# Altium schematic sheet [07]CPU-Periph.SchDoc
size A3
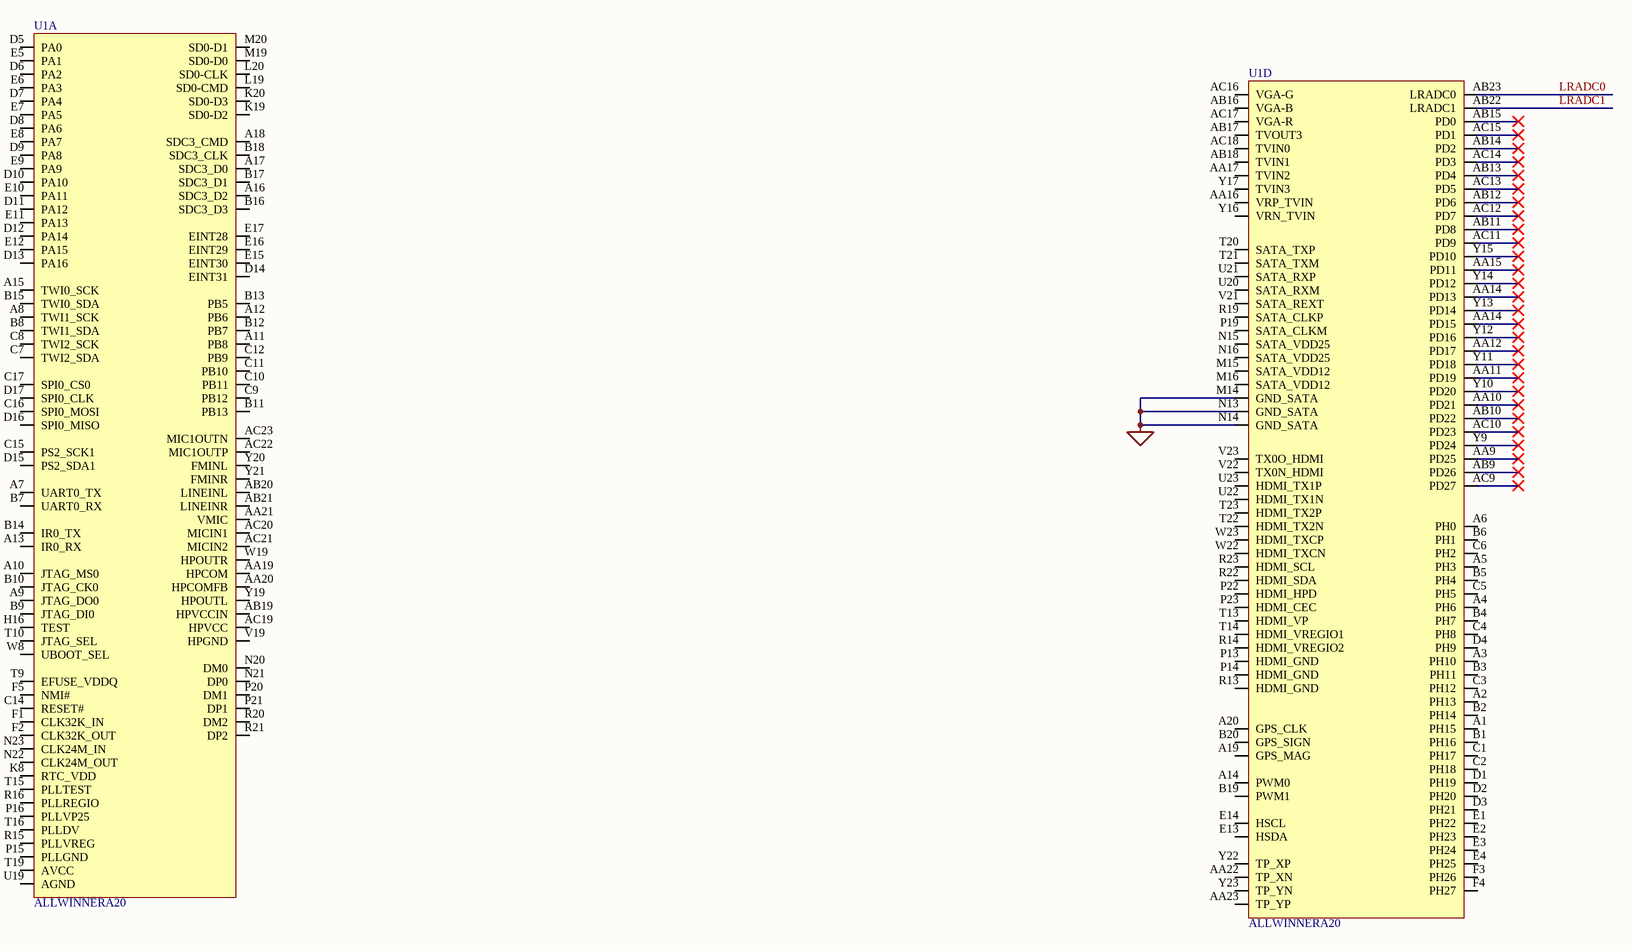
[diagram p0: [07]CPU-Periph.SchDoc]

## Parts
U1  MPN: ALLWINNERA20  [A20]  (hidden comment: Allwinner A20 SOC)  (parts A,D of 5)

## Nets
SGND: U1.M14(GND_SATA) U1.N13(GND_SATA) U1.N14(GND_SATA)
LRADC0: U1.AB23(LRADC0)
LRADC1: U1.AB22(LRADC1)

Not connected (* = marked no-connect by the designer): U1 A1(PH15) A2(PH13) A3(PH10) A4(PH6) A5(PH3) A6(PH0) A7(UART0_TX) A8(TWI1_SCK) A9(JTAG_DO0) A10(JTAG_MS0) A11(PB8) A12(PB6) A13(IR0_RX) A14(PWM0) A15(TWI0_SCK) A16(SDC3_D2) A17(SDC3_D0) A18(SDC3_CMD) A19(GPS_MAG) A20(GPS_CLK) AA9(PD25)* AA10(PD21)* AA11(PD19)* AA12(PD17)* AA14(PD13)* AA15(PD11)* AA16(VRP_TVIN) AA17(TVIN2) AA19(HPCOM) AA20(HPCOMFB) AA21(VMIC) AA22(TP_XN) AA23(TP_YP) AB9(PD26)* AB10(PD22)* AB11(PD8)* AB12(PD6)* AB13(PD4)* AB14(PD2)* AB15(PD0)* AB16(VGA-B) AB17(TVOUT3) AB18(TVIN1) AB19(HPVCCIN) AB20(LINEINL) AB21(LINEINR) AC9(PD27)* AC10(PD23)* AC11(PD9)* AC12(PD7)* AC13(PD5)* AC14(PD3)* AC15(PD1)* AC16(VGA-G) AC17(VGA-R) AC18(TVIN0) AC19(HPVCC) AC20(MICIN1) AC21(MICIN2) AC22(MIC1OUTP) AC23(MIC1OUTN) B1(PH16) B2(PH14) B3(PH11) B4(PH7) B5(PH4) B6(PH1) B7(UART0_RX) B8(TWI1_SDA) B9(JTAG_DI0) B10(JTAG_CK0) B11(PB13) B12(PB7) B13(PB5) B14(IR0_TX) B15(TWI0_SDA) B16(SDC3_D3) B17(SDC3_D1) B18(SDC3_CLK) B19(PWM1) B20(GPS_SIGN) C1(PH17) C2(PH18) C3(PH12) C4(PH8) C5(PH5) C6(PH2) C7(TWI2_SDA) C8(TWI2_SCK) C9(PB12) C10(PB11) C11(PB10) C12(PB9) C14(RESET#) C15(PS2_SCK1) C16(SPI0_MOSI) C17(SPI0_CS0) D1(PH19) D2(PH20) D3(PH21) D4(PH9) D5(PA0) D6(PA2) D7(PA4) D8(PA6) D9(PA8) D10(PA10) D11(PA12) D12(PA14) D13(PA16) D14(EINT31) D15(PS2_SDA1) D16(SPI0_MISO) D17(SPI0_CLK) E1(PH22) E2(PH23) E3(PH24) E4(PH25) E5(PA1) E6(PA3) E7(PA5) E8(PA7) E9(PA9) E10(PA11) E11(PA13) E12(PA15) E13(HSDA) E14(HSCL) E15(EINT30) E16(EINT29) E17(EINT28) F1(CLK32K_IN) F2(CLK32K_OUT) F3(PH26) F4(PH27) F5(NMI#) H16(TEST) K8(RTC_VDD) K19(SD0-D2) K20(SD0-D3) L19(SD0-CMD) L20(SD0-CLK) M15(SATA_VDD12) M16(SATA_VDD12) M19(SD0-D0) M20(SD0-D1) N15(SATA_VDD25) N16(SATA_VDD25) N20(DM0) N21(DP0) N22(CLK24M_OUT) N23(CLK24M_IN) P13(HDMI_GND) P14(HDMI_GND) P15(PLLGND) P16(PLLVP25) P19(SATA_CLKM) P20(DM1) P21(DP1) P22(HDMI_HPD) P23(HDMI_CEC) R13(HDMI_GND) R14(HDMI_VREGIO2) R15(PLLVREG) R16(PLLREGIO) R19(SATA_CLKP) R20(DM2) R21(DP2) R22(HDMI_SDA) R23(HDMI_SCL) T9(EFUSE_VDDQ) T10(JTAG_SEL) T13(HDMI_VP) T14(HDMI_VREGIO1) T15(PLLTEST) T16(PLLDV) T19(AVCC) T20(SATA_TXP) T21(SATA_TXM) T22(HDMI_TX2N) T23(HDMI_TX2P) U19(AGND) U20(SATA_RXM) U21(SATA_RXP) U22(HDMI_TX1N) U23(HDMI_TX1P) V19(HPGND) V21(SATA_REXT) V22(TX0N_HDMI) V23(TX0O_HDMI) W8(UBOOT_SEL) W19(HPOUTR) W22(HDMI_TXCN) W23(HDMI_TXCP) Y9(PD24)* Y10(PD20)* Y11(PD18)* Y12(PD16)* Y13(PD14)* Y14(PD12)* Y15(PD10)* Y16(VRN_TVIN) Y17(TVIN3) Y19(HPOUTL) Y20(FMINL) Y21(FMINR) Y22(TP_XP) Y23(TP_YN)

## Library data of the parts
U1 = ALLWINNER-A20